# Altium schematic sheet KeeWatch_Power_Supply.SchDoc
size Letter
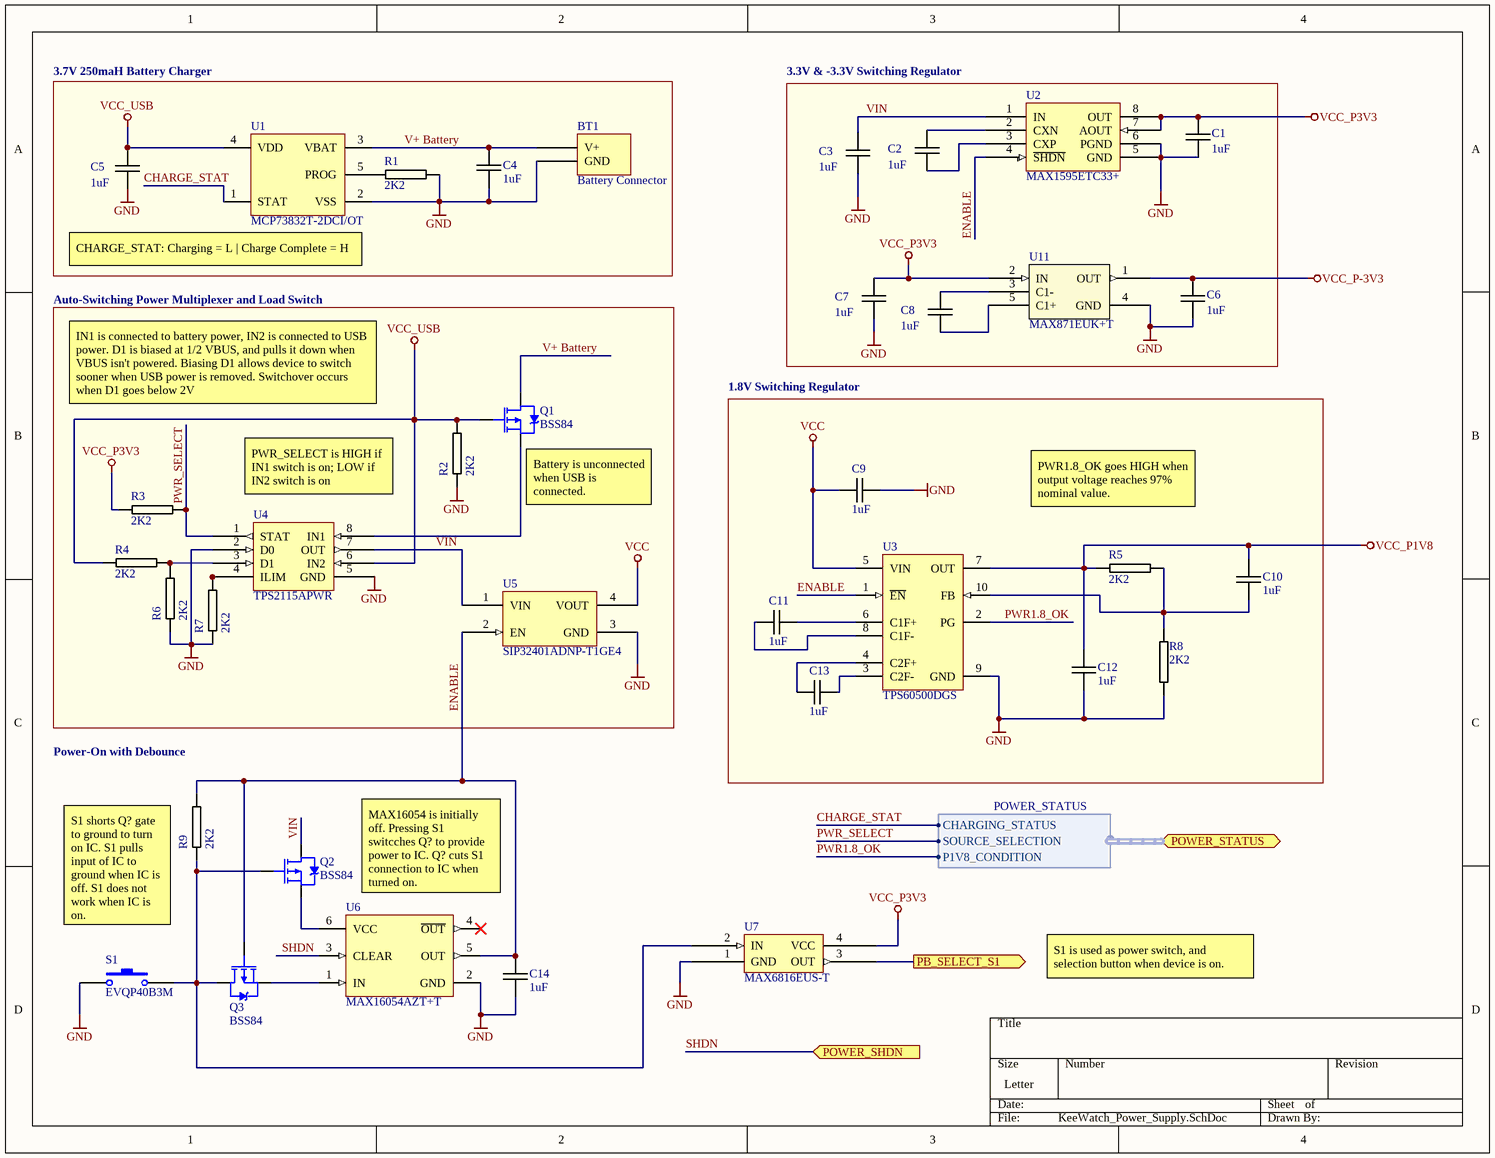
[diagram p0: KeeWatch_Power_Supply.SchDoc]

## Parts
BT1  Battery Connector  [BATTERY CONNECTOR]
C1  1uF  [0603-Cap]
C2  1uF  [0603-Cap]
C3  1uF  [0603-Cap]
C4  1uF  [0603-Cap]
C5  1uF  [0603-Cap]
C6  1uF  [0603-Cap]
C7  1uF  [0603-Cap]
C8  1uF  [0603-Cap]
C9  1uF  [0603-Cap]
C10  1uF  [0603-Cap]
C11  1uF  [0603-Cap]
C12  1uF  [0603-Cap]
C13  1uF  [0603-Cap]
C14  1uF  [0603-Cap]
Q1  BSS84  [SOT23-GDS]
Q2  BSS84  [SOT23-GDS]
Q3  BSS84  [SOT23-GDS]
R1  2K2  [0603-RES]
R2  2K2  [0603-RES]
R3  2K2  [0603-RES]
R4  2K2  [0603-RES]
R5  2K2  [0603-RES]
R6  2K2  [0603-RES]
R7  2K2  [0603-RES]
R8  2K2  [0603-RES]
R9  2K2  [0603-RES]
S1  EVQP40B3M  [EVQP4]
U1  MCP73832T-2DCI/OT  [SOT-23-OT5_N]
U2  MAX1595ETC33+  [TQFN12]
U3  TPS60500DGS  [TI-DGS10_N]
U4  TPS2115APWR  [TSSOP-8]
U5  SIP32401ADNP-T1GE4  [TDFN4]
U6  MAX16054AZT+T  [Z6+1_N]
U7  MAX6816EUS-T  [SOT143B]
U11  MAX871EUK+T  [SOT-23-OT5_N]

## Blocks framed on the sheet
3.7V 250maH Battery Charger: BT1 C4 C5 R1 U1
3.3V & -3.3V Switching Regulator: C1-C3 C6-C8 U2 U11
Auto-Switching Power Multiplexer and Load Switch: Q1 R2-R4 R6 R7 U4 U5
1.8V Switching Regulator: C9-C13 R5 R8 U3

## Ports
PB_SELECT_S1 (out), POWER_SHDN (in), POWER_STATUS (harness POWER_STATUS)

## Harnesses
POWER_STATUS: CHARGING_STATUS, SOURCE_SELECTION, P1V8_CONDITION

## Nets
GND: BT1.2(GND) C1.2 C3.2 C4.1 C5.2 C6.2 C7.2 C9.2 C12.1 C14.2 R1.2 R2.2 R6.2 R7.2 R8.1 S1.1 U1.2(VSS) U2.5(GND) U2.6(PGND) U3.9(GND) U4.2(D0) U4.5(GND) U5.3(GND) U6.2(GND) U7.1(GND) U11.4(GND)
VCC: C9.1 U3.5(VIN) U5.4(VOUT)
VCC_P1V8: C10.2 C12.2 R5.1 U3.7(OUT)
VCC_P3V3: C1.1 C7.1 R3.1 U2.7(AOUT) U2.8(OUT) U7.4(VCC) U11.2(IN)
VCC_P-3V3: C6.1 U11.1(OUT)
VCC_USB: C5.1 Q1.1(G) R2.1 R4.1 U1.4(VDD) U4.6(IN2)
CHARGE_STAT: U1.1(STAT) ; harness POWER_STATUS.CHARGING_STATUS
ENABLE: C14.1 Q3.1(G) R9.1 U2.4(~{SHDN}) U3.1(~{EN}) U5.2(EN) U6.5(OUT)
PB_SELECT_S1: U7.3(OUT) ; port PB_SELECT_S1
PWR1.8_OK: U3.2(PG) ; harness POWER_STATUS.P1V8_CONDITION
PWR_SELECT: R3.2 U4.1(STAT) ; harness POWER_STATUS.SOURCE_SELECTION
SHDN: U6.3(CLEAR) ; port POWER_SHDN
V+ Battery: BT1.1(V+) C4.2 Q1.2(D) U1.3(VBAT)
VIN: C3.1 Q2.2(D) U2.1(IN) U4.7(OUT) U5.1(VIN)
NetC2_1: C2.1 U2.2(CXN)
NetC2_2: C2.2 U2.3(CXP)
NetC8_1: C8.1 U11.3(C1-)
NetC8_2: C8.2 U11.5(C1+)
NetC10_1: C10.1 R5.2 R8.2 U3.10(FB)
NetC11_1: C11.1 U3.8(C1F-)
NetC11_2: C11.2 U3.6(C1F+)
NetC13_1: C13.1 U3.4(C2F+)
NetC13_2: C13.2 U3.3(C2F-)
NetQ1_3: Q1.3(S) U4.8(IN1)
NetQ2_1: Q2.1(G) Q3.2(D) R9.2 S1.2 U7.2(IN)
NetQ2_3: Q2.3(S) U6.6(VCC)
NetQ3_3: Q3.3(S) U6.1(IN)
NetR1_1: R1.1 U1.5(PROG)
NetR4_2: R4.2 R6.1 U4.3(D1)
NetR7_1: R7.1 U4.4(ILIM)

Not connected (* = marked no-connect by the designer): U6 4(~{OUT})*

## Notes on the sheet
- (near U1) CHARGE_STAT: Charging = L | Charge Complete = H
- IN1 is connected to battery power, IN2 is connected to USB power. D1 is biased at 1/2 VBUS, and pulls it down when VBUS isn't powered. Biasing D1 allows device to switch sooner when USB power is removed. Switchover occurs when D1 goes below 2V
- PWR_SELECT is HIGH if IN1 switch is on; LOW if IN2 switch is on
- (near Q1) Battery is unconnected when USB is connected.
- PWR1.8_OK goes HIGH when output voltage reaches 97% nominal value.
- (near R9) Power-On with Debounce
- (near U6) MAX16054 is initially off. Pressing S1 switcches Q? to provide power to IC. Q? cuts S1 connection to IC when turned on.
- (near R9) S1 shorts Q? gate to ground to turn on IC. S1 pulls input of IC to ground when IC is off. S1 does not work when IC is on.
- S1 is used as power switch, and selection button when device is on.

## Library data of the parts
BT1 = Battery Connector: 3.7V 250maH Battery Connector
C1-C14 = 0603-Cap: CAPACITOR 0603 CERAMIC
R1-R9 = 0603-Res: GENERIC RESISTOR 0603
U1 = MCP73832T-2DCI/OT: Miniature Single-Cell, Fully Integrated Li-Ion, Li-Polymer Charge Management Controller, 4.2V, 5-Pin SOT-23, Industrial Temperature, Tape and Reel; Manufacturer: Microchip; DatasheetVersion: revE, Sep-2008; PackageVersion: revBB, Aug-2009; PackageReference: SOT-23-OT5; PackageDescription: 5-Lead Plastic Small Outline Transistor (OT) [SOT-23]; Supplier 1: Digi-Key; Supplier Part Number 1: MCP73832T-2DCI/OTTR-ND; Supplier 2: Digi-Key; Supplier Part Number 2: MCP73832T-2DCI/OTCT-ND; Supplier 3: Digi-Key; Supplier Part Number 3: MCP73832T-2DCI/OTDKR-ND; Supplier 4: Farnell; Supplier Part Number 4: 1834892RL; Supplier 5: Farnell; Supplier Part Number 5: 1834892; Supplier 6: Newark; Supplier Part Number 6: 84R5198; Supplier 7: Mouser; Supplier Part Number 7: 579-MCP73832T-2DCIOT; Mounting Technology: Surface Mount; Code_IPC: SOT23-5; PartNumber: MCP73832T-2DCI/OT; ComponentLink1Description: Manufacturer URL; ComponentLink1URL: http://www.microchip.com/; ComponentLink2Description: Datasheet; ComponentLink2URL: http://ww1.microchip.com/downloads/en/DeviceDoc/21984e.pdf; ComponentLink3Description: Package Specification; ComponentLink3URL: http://www.microchip.com/stellent/groups/techpub_sg/documents/packagingspec/en012702.pdf
U2 = MAX1595ETC33+: Regulated 3.3V/5.0V Step-Up/Step-Down Charge Pump
U3 = TPS60500DGS: 0.8 to 3.3 V, Step-Down Charge Pump Regulator, 250 mA, 1.8 to 6.5 V Input with 2-Cell Alkaline / Nixx Input, -40 to 85 degC, 10-pin SOP (DGS10), Green (RoHS & no Sb/Br); Manufacturer: Texas Instruments; 2-Cell Alkaline/Nixx Input: TRUE; Iout(Max)(A): 0.25; Iq(Typ)(mA): 0.04; Switching Frequency(Max)(kHz): 1200; Topology: Buck; Vin(Max)(V): 6.5; Vin(Min)(V): 1.8; Vout(Max)(V): 3.3; Vout(Min)(V): 0.8; DatasheetVersion: SLVS391B; PackageVersion: 4073225-6/I; PackageReference: DGS10; PackageDescription: 10-Pin Plastic Small Outline, Body 3.00 x 3.00 mm, Pitch 0.50 mm; Supplier 1: Digi-Key; Supplier Part Number 1: 296-12513-5-ND; Supplier 2: Newark; Supplier Part Number 2: 77C0633; Supplier 3: Mouser; Supplier Part Number 3: 595-TPS60500DGS; Eco-Plan: Green (RoHS & no Sb/Br); Mounting Technology: Surface Mount; Code_JEDEC: MO-153; PartNumber: TPS60500DGS; ComponentLink1Description: Manufacturer URL; ComponentLink1URL: http://www.ti.com/; ComponentLink2Description: Datasheet; ComponentLink2URL: http://www.ti.com/general/docs/lit/getliterature.tsp?genericPartNumber=TPS60500&fileType=pdf; ComponentLink3Description: Package Specification; ComponentLink3URL: http://www.ti.com/litv/pdf/mpds373
U4 = TPS2115APWR: Auto-switching Power MUX
U5 = SIP32401ADNP-T1GE4: 1.1 V to 5.5 V, Slew Rate Controlled Load SwitcH
U6 = MAX16054AZT+T: On/Off Controller with Debounce and +/-15kV ESD Protection, 6-Pin SOT, -40°C to +125°C, Pb-Free, Tape and Reel; DatasheetVersion: Rev 0, May-2008; PackageVersion: revD, 2011; PackageReference: z6+1; PackageDescription: 6-Pin Thin Small-Outline Transistor, 2.9 x 1.6 mm Body, 0.95 mm Pitch, 2.8 mm Lead Span, SOT-23, Pb-Free; Code_JEITA: SC-74; Code_JEDEC: MO-193*; ComponentLink1Description: Manufacturer URL; ComponentLink1URL: http://www.maxim-ic.com; ComponentLink2Description: Datasheet; ComponentLink2URL: http://datasheets.maxim-ic.com/en/ds/MAX16054.pdf; ComponentLink3Description: Package Specification; ComponentLink3URL: http://pdfserv.maxim-ic.com/package_dwgs/21-0114.PDF
U11 = MAX871EUK+T: Switched-Capacitor Voltage Inverters; Vendor: MAXIM; Manufacturer_Part_Number: max871euk+t; RefDes: RefDes; Type: Type; Value: Value